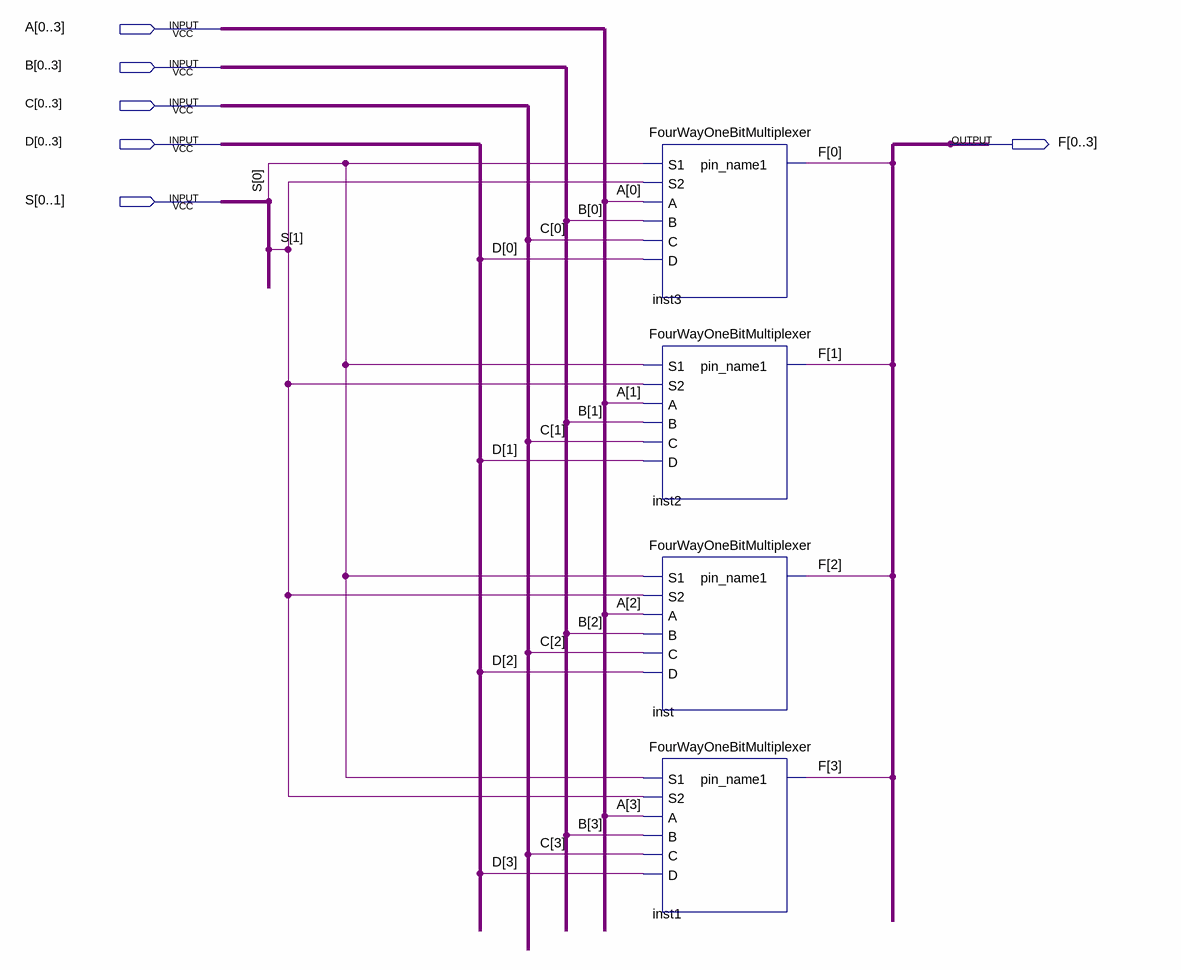
[diagram p0: schematic sheet]
// Quartus schematic FourWayFourBitMultiplexer.bdf as structural Verilog: 4 symbols, 6 pins
module FourWayFourBitMultiplexer (
  input  [0:3] A,
  input  [0:3] B,
  input  [0:3] C,
  input  [0:3] D,
  input  [0:1] S,
  output [0:3] F
);

  FourWayOneBitMultiplexer inst3 (.S1(S[0]), .S2(S[1]), .A(A[0]), .B(B[0]), .C(C[0]), .D(D[0]), .pin_name1(F[0]));
  FourWayOneBitMultiplexer inst2 (.S1(S[0]), .S2(S[1]), .A(A[1]), .B(B[1]), .C(C[1]), .D(D[1]), .pin_name1(F[1]));
  FourWayOneBitMultiplexer inst (.S1(S[0]), .S2(S[1]), .A(A[2]), .B(B[2]), .C(C[2]), .D(D[2]), .pin_name1(F[2]));
  FourWayOneBitMultiplexer inst1 (.S1(S[0]), .S2(S[1]), .A(A[3]), .B(B[3]), .C(C[3]), .D(D[3]), .pin_name1(F[3]));
endmodule
